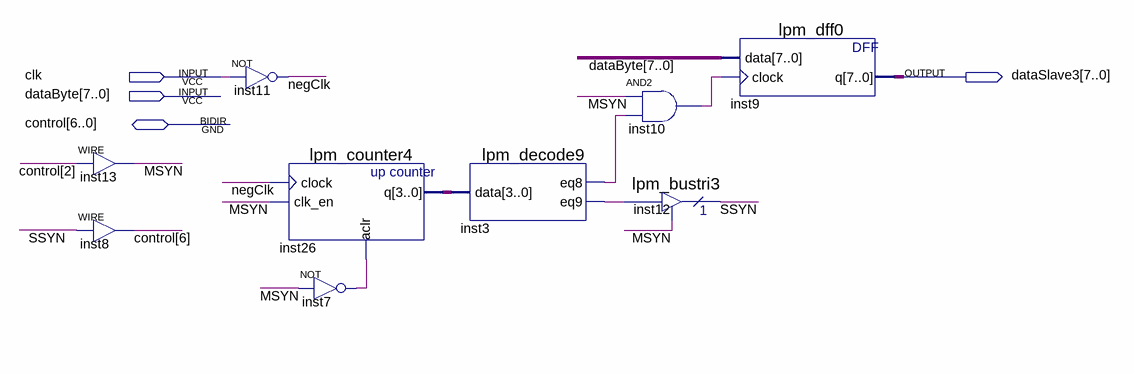
[diagram p0: schematic sheet]
// Quartus schematic Slave3.bdf as structural Verilog: 9 symbols, 4 pins
module Slave3 (
  input  clk,
  input  [7:0] dataByte,
  inout  [6:0] control,
  output [7:0] dataSlave3
);

  wire inst3_eq8, inst3_eq9, inst7_out, inst10_out, MSYN, negClk, SSYN;
  wire [3:0] inst26_q;

  assign MSYN = control[2];  // WIRE inst13
  assign control[6] = SSYN;  // WIRE inst8
  not inst11 (negClk, clk);
  lpm_counter4 inst26 (.clock(negClk), .clk_en(MSYN), .aclr(inst7_out), .q(inst26_q));
  not inst7 (inst7_out, MSYN);
  lpm_decode9 inst3 (.data(inst26_q), .eq8(inst3_eq8), .eq9(inst3_eq9));
  and inst10 (inst10_out, MSYN, inst3_eq8);
  lpm_bustri3 inst12 (.enabledt(MSYN), .data(inst3_eq9), .tridata(SSYN));
  lpm_dff0 inst9 (.data(dataByte), .clock(inst10_out), .q(dataSlave3));
endmodule
